# Altium schematic sheet [04]-BUTTON.SchDoc
size A
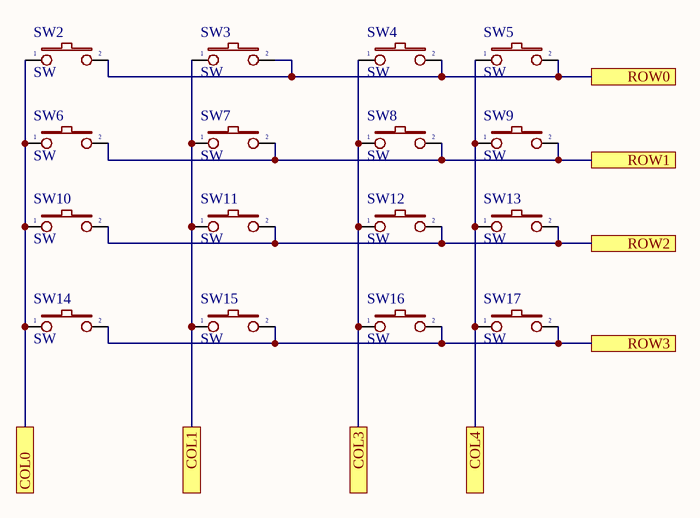
[diagram p0: [04]-BUTTON.SchDoc]

## Parts
SW2  SW  [SW2]
SW3  SW  [SW2]
SW4  SW  [SW2]
SW5  SW  [SW2]
SW6  SW  [SW2]
SW7  SW  [SW2]
SW8  SW  [SW2]
SW9  SW  [SW2]
SW10  SW  [SW2]
SW11  SW  [SW2]
SW12  SW  [SW2]
SW13  SW  [SW2]
SW14  SW  [SW2]
SW15  SW  [SW2]
SW16  SW  [SW2]
SW17  SW  [SW2]

## Ports
COL0, COL1, COL3, COL4, ROW0, ROW1, ROW2, ROW3

## Nets
COL0: SW2.1 SW6.1 SW10.1 SW14.1 ; port COL0
COL1: SW3.1 SW7.1 SW11.1 SW15.1 ; port COL1
COL3: SW4.1 SW8.1 SW12.1 SW16.1 ; port COL3
COL4: SW5.1 SW9.1 SW13.1 SW17.1 ; port COL4
ROW0: SW2.2 SW3.2 SW4.2 SW5.2 ; port ROW0
ROW1: SW6.2 SW7.2 SW8.2 SW9.2 ; port ROW1
ROW2: SW10.2 SW11.2 SW12.2 SW13.2 ; port ROW2
ROW3: SW14.2 SW15.2 SW16.2 SW17.2 ; port ROW3

## Library data of the parts
SW2-SW17 = SW2: Switch button 2 pin; Value: SW chip 2 pin